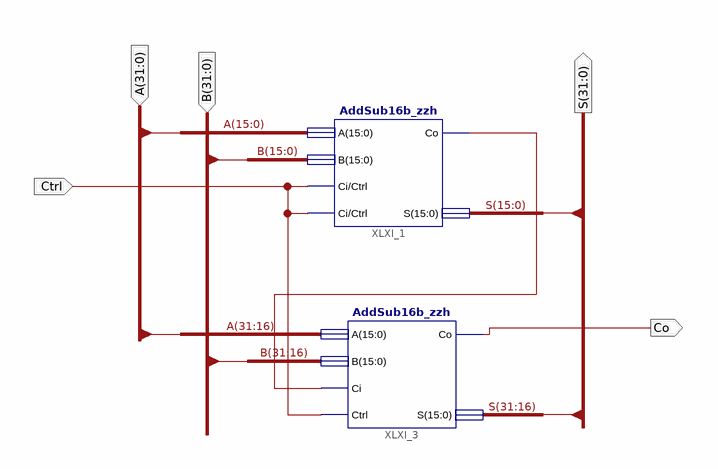
[diagram p0: schematic sheet 1]
// Xilinx ISE schematic AddSub32b_zzh.sch (kintex7) as structural Verilog: 2 symbols, 5 ports
module AddSub32b_zzh (
  input  Ctrl,
  input  [31:0] A,
  input  [31:0] B,
  output Co,
  output [31:0] S
);

  wire XLXN_1;

  AddSub16b_zzh XLXI_1 (.A(A[15:0]), .B(B[15:0]), .Ci(Ctrl), .Ctrl(Ctrl), .Co(XLXN_1), .S(S[15:0]));
  AddSub16b_zzh XLXI_3 (.A(A[31:16]), .B(B[31:16]), .Ci(XLXN_1), .Ctrl(Ctrl), .Co(Co), .S(S[31:16]));
endmodule
